# Altium schematic sheet EFR32BG24_PartB.SchDoc: LPEDT_Project_Schematic
size A; Revision: 1; SheetNumber: 5; SheetTotal: 7
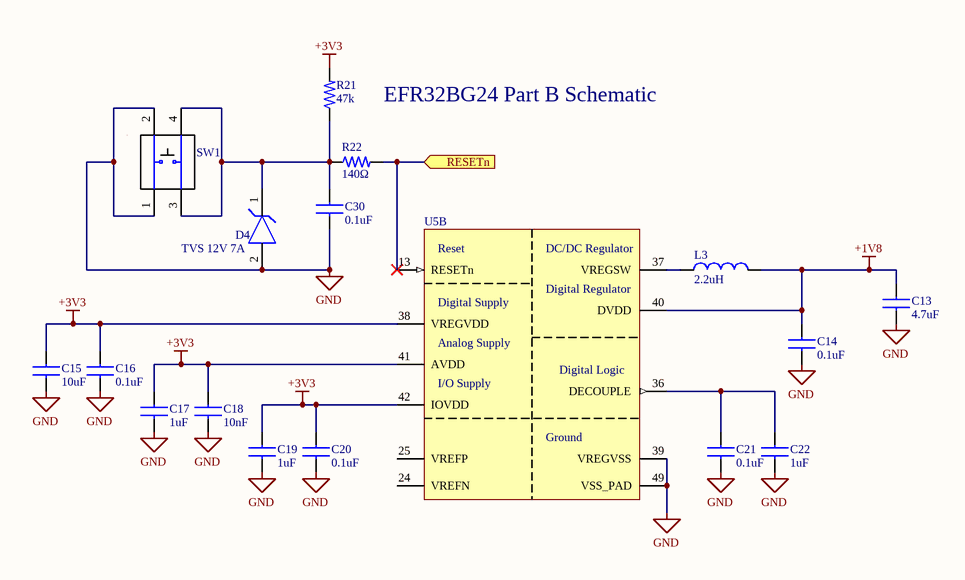
[diagram p0: EFR32BG24_PartB.SchDoc]

## Parts
C13  4.7uF  [C_0603]
C14  0.1uF  [C_0603]
C15  10uF  [C_0603]
C16  0.1uF  [C_0603]
C17  1uF  [C_0603]
C18  10nF  [C_0603]
C19  1uF  [C_0603]
C20  0.1uF  [C_0603]
C21  0.1uF  [C_0603]
C22  1uF  [C_0603]
C30  0.1uF  [C_0603]
D4  TVS 12V 7A  [D_TVS]
L3  2.2uH  [L_2828x30]
R21  47k  [R_0603]
R22  140Ω  [R_0603]
SW1  SW_TactilePushButton  [SW_Tactile]  (value not drawn)
U5  EFR32BG24B110F1536IM48-B  [U_48QFN_6x6_2]  (value not drawn)  (part B of 3)

## Ports
RESETn (in, see EFR32BG24_PartC[4A])

## Nets
+1V8: C13.1 C14.1 L3.2 U5.40(DVDD)
+3V3: C15.1 C16.2 C17.2 C18.1 C19.2 C20.2 R21.2 U5.38(VREGVDD) U5.41(AVDD) U5.42(IOVDD)
GND: C13.2 C14.2 C15.2 C16.1 C17.1 C18.2 C19.1 C20.1 C21.2 C22.2 C30.2 D4.2 SW1.1 SW1.2 U5.39(VREGVSS) U5.49(VSS_PAD)
RESETn: R22.2 U5.13(RESETn) ; port RESETn
NetC21_1: C21.1 C22.1 U5.36(DECOUPLE)
NetC30_1: C30.1 D4.1 R21.1 R22.1 SW1.3 SW1.4
NetL3_1: L3.1 U5.37(VREGSW)

Not connected (* = marked no-connect by the designer): U5 24(VREFN) 25(VREFP)

## Notes on the sheet
- EFR32BG24 Part B Schematic
- (in symbol EFR32BG24B110F1536IM48-B, part B) Reset; DC/DC Regulator; Digital Regulator; Digital Supply; Analog Supply; Digital Logic; I/O Supply; Ground

## Library data of the parts
C13 = C_4.7U_0603: CAP CER 4.7UF 10V X5R 0603; Manufacturer: Murata; Manufacturer Part Number: GRM188R61A475KAAJD; Dielectric Material: Ceramic; Multilayer: Yes; Tolerance  (fill in as +-): 10%; Supplier: Digikey; Supplier Part Number: 490-14373-1-ND; RoHS: Yes; Category: Ceramic Capacitors; Stock: 53982; Pricing: 1=0.38, 10=0.251, 50=0.185, 100=0.1506, 500=0.11888, 1000=0.10039 (USD); Mounting Technology: Surface Mount; Pins: 2; Package Shape: Rectangular; Case/Package: 0603; Terminal Finish: Nickel; Min Operating Temperature: -55°C; Max Operating Temperature: 85°C; JESD-609 Code: e3; Value: 4.7uF; Capacitor Type: Ceramic; Packaging: Tape and Reel; Tolerance (fill in as +-): 10%; Rated DC Voltage (URdc): 10V; Temperature Characteristics Code: X5R; Termination: Wraparound; Reach SVHC Compliant: Yes; RoHS Compliant: Yes; ComponentLink1URL: https://datasheet.ciiva.com:443/pdfs/VipMasterIC/IC/MURE/MURE-S-A0004349797/MURE-S-A0004352595-1.pdf?src-supplier=IHS+Markit; ComponentLink1Description: https://datasheet.ciiva.com:443/pdfs/VipMasterIC/IC/MURE/MURE-S-A0004349797/MURE-S-A0004352595-1.pdf?src-supplier=IHS+Markit; ComponentLink2URL: http://search.murata.co.jp/Ceramy/image/img/A01X/G101/ENG/GRM188R61A475KAAJ-01.pdf?src-supplier=Digikey; ComponentLink2Description: http://search.murata.co.jp/Ceramy/image/img/A01X/G101/ENG/GRM188R61A475KAAJ-01.pdf?src-supplier=Digikey
C14 C16 C20 C21 C30 = C_0.1U_0603: CAP CER 0.1UF 10V X5R 0603; Manufacturer: KEMET; Manufacturer Part Number: C0603C104K8PAC7867; Dielectric Material: Ceramic; Supplier: Digikey; Supplier Part Number: 399-17573-1-ND; RoHS: Yes; Category: Ceramic Capacitors; Stock: 13122; Pricing: 1=0.18, 10=0.119, 50=0.075, 100=0.06, 500=0.04332, 1000=0.03833 (USD); Pins: 2; Capacitor Type: Ceramic; Reach SVHC Compliant: Yes; RoHS Compliant: Yes; ComponentLink1URL: https://datasheet.ciiva.com:443/pdfs/VipMasterIC/IC/KEME/KEME-S-A0007617622/KEME-S-A0007611556-1.pdf?src-supplier=IHS+Markit; ComponentLink1Description: https://datasheet.ciiva.com:443/pdfs/VipMasterIC/IC/KEME/KEME-S-A0007617622/KEME-S-A0007611556-1.pdf?src-supplier=IHS+Markit; ComponentLink2URL: https://api.kemet.com/component-edge/download/datasheet/C0603C104K8PAC7867.pdf?src-supplier=Digikey; ComponentLink2Description: https://api.kemet.com/component-edge/download/datasheet/C0603C104K8PAC7867.pdf?src-supplier=Digikey
C15 = C_10U_0603: CAP CER 10UF 10V X5R 0603; Manufacturer: Murata; Manufacturer Part Number: GRM188R61A106ME69D; Dielectric Material: Ceramic; Multilayer: Yes; Tolerance  (fill in as +-): 20%; Supplier: Digikey; Supplier Part Number: 490-10475-1-ND; RoHS: Yes; Category: Ceramic Capacitors; Stock: 841748; Pricing: 1=0.14, 10=0.098, 50=0.0584, 100=0.0459, 500=0.03392, 1000=0.02809 (USD); Mounting Technology: Surface Mount; Pins: 2; Package Shape: Rectangular; Case/Package: 0603; Terminal Finish: Nickel; Min Operating Temperature: -55°C; Max Operating Temperature: 85°C; JESD-609 Code: e3; Value: 10uF; Capacitor Type: Ceramic; Packaging: Tape and Reel; Tolerance (fill in as +-): 20%; Rated DC Voltage (URdc): 10V; Temperature Characteristics Code: X5R; Termination: Wraparound; Reach SVHC Compliant: Yes; RoHS Compliant: Yes; ComponentLink1URL: https://datasheet.ciiva.com:443/pdfs/VipMasterIC/IC/MURE/MURE-S-A0004349797/MURE-S-A0004352786-1.pdf?src-supplier=IHS+Markit; ComponentLink1Description: https://datasheet.ciiva.com:443/pdfs/VipMasterIC/IC/MURE/MURE-S-A0004349797/MURE-S-A0004352786-1.pdf?src-supplier=IHS+Markit; ComponentLink2URL: http://www.farnell.com/datasheets/1872210.pdf?src-supplier=Farnell; ComponentLink2Description: http://www.farnell.com/datasheets/1872210.pdf?src-supplier=Farnell; ComponentLink3URL: http://www.mouser.com/ds/2/281/c02e-2905.pdf?src-supplier=Mouser; ComponentLink3Description: http://www.mouser.com/ds/2/281/c02e-2905.pdf?src-supplier=Mouser; ComponentLink4URL: https://datasheet.octopart.com/GRM188R61A106ME69D-Murata-datasheet-22122223.pdf?src-supplier=Future+Electronics; ComponentLink4Description: https://datasheet.octopart.com/GRM188R61A106ME69D-Murata-datasheet-22122223.pdf?src-supplier=Future+Electronics; ComponentLink5URL: https://datasheet.octopart.com/GRM188R61A106ME69D-Murata-datasheet-62317187.pdf?src-supplier=Element14; ComponentLink5Description: https://datasheet.octopart.com/GRM188R61A106ME69D-Murata-datasheet-62317187.pdf?src-supplier=Element14; ComponentLink6URL: http://www.farnell.com/datasheets/1872210.pdf?src-supplier=Newark; ComponentLink6Description: http://www.farnell.com/datasheets/1872210.pdf?src-supplier=Newark; ComponentLink7URL: http://www.farnell.com/datasheets/2048014.pdf?src-supplier=Element14; ComponentLink7Description: http://www.farnell.com/datasheets/2048014.pdf?src-supplier=Element14; ComponentLink8URL: https://datasheet.octopart.com/GRM188R61A106ME69D-Murata-datasheet-165579666.pdf?src-supplier=TME; ComponentLink8Description: https://datasheet.octopart.com/GRM188R61A106ME69D-Murata-datasheet-165579666.pdf?src-supplier=TME
C17 C19 C22 = C_1U_0603: CAP CER 1UF 10V X5R 0603; Manufacturer: Murata; Manufacturer Part Number: GRM188R61A105KA61D; Dielectric Material: Ceramic; Multilayer: Yes; Tolerance  (fill in as +-): 10%; Supplier: Digikey; Supplier Part Number: 490-1543-1-ND; RoHS: Yes; Category: Ceramic Capacitors; Stock: 1314759; Pricing: 1=0.12, 10=0.08, 50=0.048, 100=0.0378, 500=0.02794, 1000=0.02313 (USD); Mounting Technology: Surface Mount; Pins: 2; Package Shape: Rectangular; Case/Package: 0603; Terminal Finish: Nickel; Min Operating Temperature: -55°C; Max Operating Temperature: 85°C; JESD-609 Code: e3; Value: 1uF; Capacitor Type: Ceramic; Package Style: SMTMeter; Packaging: Tape and Reel; Tolerance (fill in as +-): 10%; Rated DC Voltage (URdc): 10V; Temperature Characteristics Code: X5R; Termination: Wraparound; Length: 1.6mm; Width: 0.8mm; Height: 0.8mm; Reach SVHC Compliant: Yes; RoHS Compliant: Yes; ComponentLink1URL: https://psearch.en.murata.com:443/capacitor/product/GRM188R61A105KA61%23.pdf?src-supplier=IHS+Markit; ComponentLink1Description: https://psearch.en.murata.com:443/capacitor/product/GRM188R61A105KA61%23.pdf?src-supplier=IHS+Markit; ComponentLink2URL: https://datasheet.ciiva.com/19476/1857381-19476568.pdf?src-supplier=Jameco; ComponentLink2Description: https://datasheet.ciiva.com/19476/1857381-19476568.pdf?src-supplier=Jameco; ComponentLink3URL: https://datasheet.ciiva.com/18102/getdatasheetpartid-85467-18102910.pdf?src-supplier=Verical; ComponentLink3Description: https://datasheet.ciiva.com/18102/getdatasheetpartid-85467-18102910.pdf?src-supplier=Verical; ComponentLink4URL: https://datasheet.ciiva.com/7719/608985-7719036.pdf?src-supplier=Element14; ComponentLink4Description: https://datasheet.ciiva.com/7719/608985-7719036.pdf?src-supplier=Element14; ComponentLink5URL: https://datasheet.ciiva.com/22706/608985-22706782.pdf?src-supplier=Element14; ComponentLink5Description: https://datasheet.ciiva.com/22706/608985-22706782.pdf?src-supplier=Element14; ComponentLink6URL: https://datasheet.ciiva.com/131/partnumbering-e-01-131742.pdf?src-supplier=Digikey; ComponentLink6Description: https://datasheet.ciiva.com/131/partnumbering-e-01-131742.pdf?src-supplier=Digikey; ComponentLink7URL: https://datasheet.ciiva.com/131/partnumbering-e-01-131741.pdf?src-supplier=Digikey; ComponentLink7Description: https://datasheet.ciiva.com/131/partnumbering-e-01-131741.pdf?src-supplier=Digikey; ComponentLink8URL: https://datasheet.ciiva.com/131/partnumbering-e-01-131743.pdf?src-supplier=Digikey; ComponentLink8Description: https://datasheet.ciiva.com/131/partnumbering-e-01-131743.pdf?src-supplier=Digikey; ComponentLink9URL: https://datasheet.ciiva.com/16199/product-16199724.pdf?src-supplier=Future+Electronics; ComponentLink9Description: https://datasheet.ciiva.com/16199/product-16199724.pdf?src-supplier=Future+Electronics
C18 = C_10N_0603: Ceramic Capacitor, Multilayer, Ceramic, 100V, 10% +Tol, 10% -Tol, X7R, 15% TC, 0.01uF, Surface Mount, 0603; Manufacturer: Murata; Manufacturer Part Number: GCM188R72A103KA37D; Multilayer: Yes; Reference Standard: AEC-Q200; Supplier: Digikey; Supplier Part Number: 490-4781-6-ND; RoHS: Yes; Category: Ceramic Capacitors; Stock: 7901608; Pricing: 1=0.1, 10=0.038, 50=0.0218, 100=0.0168, 500=0.01268, 1000=0.00996 (USD); Mounting Technology: Surface Mount; Pins: 2; Dielectric Material: Ceramic; Package Shape: Rectangular; Case/Package: 0603; Terminal Finish: Nickel; Min Operating Temperature: -55°C; Max Operating Temperature: 125°C; JESD-609 Code: e3; Value: 10nF; Capacitor Type: Ceramic; Tolerance  (fill in as +-): 10%; Package Style: SMTMeter; Packaging: Tape and Reel; Tolerance (fill in as +-): 10%; Rated DC Voltage (URdc): 100V; Temperature Characteristics Code: X7R; Termination: Wraparound; Length: 1.6mm; Width: 0.8mm; Height: 0.9mm; Reach SVHC Compliant: Yes; RoHS Compliant: Yes; ComponentLink1URL: https://psearch.en.murata.com:443/capacitor/product/GCM188R72A103KA37%23.pdf?src-supplier=IHS+Markit; ComponentLink1Description: https://psearch.en.murata.com:443/capacitor/product/GCM188R72A103KA37%23.pdf?src-supplier=IHS+Markit; ComponentLink2URL: https://datasheet.ciiva.com/132/product-132908.pdf?src-supplier=Digikey; ComponentLink2Description: https://datasheet.ciiva.com/132/product-132908.pdf?src-supplier=Digikey; ComponentLink3URL: https://datasheet.ciiva.com/132/product-132907.pdf?src-supplier=Digikey; ComponentLink3Description: https://datasheet.ciiva.com/132/product-132907.pdf?src-supplier=Digikey; ComponentLink4URL: https://datasheet.ciiva.com/132/product-132909.pdf?src-supplier=Digikey; ComponentLink4Description: https://datasheet.ciiva.com/132/product-132909.pdf?src-supplier=Digikey; ComponentLink5URL: https://datasheet.ciiva.com/11786/0900766b80ef92d0-11786108.pdf?src-supplier=Rs; ComponentLink5Description: https://datasheet.ciiva.com/11786/0900766b80ef92d0-11786108.pdf?src-supplier=Rs; ComponentLink6URL: https://datasheet.ciiva.com/16497/product-16497251.pdf?src-supplier=Future+Electronics; ComponentLink6Description: https://datasheet.ciiva.com/16497/product-16497251.pdf?src-supplier=Future+Electronics; ComponentLink7URL: https://datasheet.ciiva.com/18183/getdatasheetpartid-178890-18183651.pdf?src-supplier=Verical; ComponentLink7Description: https://datasheet.ciiva.com/18183/getdatasheetpartid-178890-18183651.pdf?src-supplier=Verical; ComponentLink8URL: https://datasheet.ciiva.com/11619/product-11619719.pdf?src-supplier=Avnet; ComponentLink8Description: https://datasheet.ciiva.com/11619/product-11619719.pdf?src-supplier=Avnet
D4 = D_TVS_7A: TVS DIODE 5VWM 12VC SOD723; Manufacturer: Littelfuse; Manufacturer Part Number: SP1003-01DTG; Direction: Unidirectional; Reverse Breakdown Voltage: 6V; Operating Supply Voltage: 5V; Value: 30pF; Number of Channels: 1; Power Line Protection: No; Polarity: Bidirectional,Unidirectional; Test Current: 1mA; Leakage Current: 100nA; Diode Type: ZENER; Clamping Voltage-Max: 12.5V; Supplier: Digikey; Supplier Part Number: F3377CT-ND; RoHS: Yes; Category: TVS Diodes; Stock: 109631; Pricing: 1=0.53, 10=0.41, 100=0.2459, 500=0.22772, 1000=0.15485, 2000=0.14255 (USD); Mounting Technology: Surface Mount; Pins: 2; Min Operating Temperature: -40°C; Max Operating Temperature: 85°C; Packaging: Tape and Reel; Package Quantity: 8000; Max Surge Current: 7A; Number of Unidirectional Channels: 1; Reverse Standoff Voltage: 5V; Min Breakdown Voltage: 6V; Clamping Voltage: 12V; Breakdown Voltage: 5V; Termination: SMD/SMT; Number of Elements: 1; Peak Pulse Current: 7A; Series: SP1003, SPA®; Reach SVHC Compliant: No; Lead Free: Lead Free; RoHS Compliant: Yes; ComponentLink1URL: https://datasheet.ciiva.com/8062/littelfuse-spa-sp1003-series-8062432.pdf?src-supplier=Element14; ComponentLink1Description: https://datasheet.ciiva.com/8062/littelfuse-spa-sp1003-series-8062432.pdf?src-supplier=Element14; ComponentLink2URL: https://datasheet.ciiva.com/5771/littelfuse-spa-sp1003-series-5771141.pdf?src-supplier=Farnell; ComponentLink2Description: https://datasheet.ciiva.com/5771/littelfuse-spa-sp1003-series-5771141.pdf?src-supplier=Farnell; ComponentLink3URL: https://datasheet.ciiva.com/330/littelfuse-tvs-diode-array-sp1003-datasheet-pdf-330691.pdf?src-supplier=Digikey; ComponentLink3Description: https://datasheet.ciiva.com/330/littelfuse-tvs-diode-array-sp1003-datasheet-pdf-330691.pdf?src-supplier=Digikey; ComponentLink4URL: https://datasheet.ciiva.com/330/littelfuse-tvs-diode-array-sp1003-datasheet-pdf-330692.pdf?src-supplier=Digikey; ComponentLink4Description: https://datasheet.ciiva.com/330/littelfuse-tvs-diode-array-sp1003-datasheet-pdf-330692.pdf?src-supplier=Digikey; ComponentLink5URL: https://datasheet.ciiva.com/330/littelfuse-tvs-diode-array-sp1003-datasheet-pdf-330693.pdf?src-supplier=Digikey; ComponentLink5Description: https://datasheet.ciiva.com/330/littelfuse-tvs-diode-array-sp1003-datasheet-pdf-330693.pdf?src-supplier=Digikey
L3 = L_2U2_2828: General Purpose Inductor, 2.2uH, 20%, 1 Element, Ferrite-Core, SMD, 1111; Manufacturer: Wurth Electronics; Manufacturer Part Number: 744025002; Channels: 1; Case/Size Code: 1111; DC Resistance (DCR): 101mR; Inductor Application: RF INDUCTOR; Max Current Rating: 1.5A; Self Resonant Frequency: 100MHz; Shape/Size Description: RECTANGULAR PACKAGE; Shielding: Unshielded; Test Frequency: 100kHz; Package Height: 2.8mm; Supplier: Digikey; Supplier Part Number: 732-2613-1-ND; RoHS: Yes; Category: Fixed Inductors; Stock: 733; Pricing: 1=1.64, 10=1.578, 50=1.45, 100=1.205, 250=1.088 (USD); Pins: 2; Terminal Finish: Copper; Core Material: Ferrite; Min Operating Temperature: -40°C; Max Operating Temperature: 125°C; Tolerance: 20%; JESD-609 Code: e2; Package Style: SMTMeter; Surface Mount: Yes; Construction: Chip; Inductance-Nom (L): 2.2uH; Inductor Type: GENERAL PURPOSE INDUCTOR; Packaging: Tape and Reel; Terminal Placement: Dual Ended; Termination: Wraparound; Package Length: 2.8mm; Package Width: 2.8mm; Reach SVHC Compliant: Yes; RoHS Compliant: Yes; ComponentLink1URL: https://datasheet.ciiva.com:443/pdfs/VipMasterIC/IC/MIDC/MIDC-S-A0002801410/MIDC-S-A0002801309-1.pdf?src-supplier=IHS+Markit; ComponentLink1Description: https://datasheet.ciiva.com:443/pdfs/VipMasterIC/IC/MIDC/MIDC-S-A0002801410/MIDC-S-A0002801309-1.pdf?src-supplier=IHS+Markit; ComponentLink2URL: https://datasheet.ciiva.com/4954/744025002-18097-4954597.pdf?src-supplier=Mouser; ComponentLink2Description: https://datasheet.ciiva.com/4954/744025002-18097-4954597.pdf?src-supplier=Mouser; ComponentLink3URL: https://datasheet.ciiva.com/6690/744025002-6690395.pdf?src-supplier=Digikey; ComponentLink3Description: https://datasheet.ciiva.com/6690/744025002-6690395.pdf?src-supplier=Digikey; ComponentLink4URL: https://datasheet.ciiva.com/11803/0900766b80f886b4-11803596.pdf?src-supplier=Rs; ComponentLink4Description: https://datasheet.ciiva.com/11803/0900766b80f886b4-11803596.pdf?src-supplier=Rs; ComponentLink5URL: https://datasheet.ciiva.com/6690/744025002-6690396.pdf?src-supplier=Digikey; ComponentLink5Description: https://datasheet.ciiva.com/6690/744025002-6690396.pdf?src-supplier=Digikey; ComponentLink6URL: https://datasheet.ciiva.com/6690/744025002-6690397.pdf?src-supplier=Digikey; ComponentLink6Description: https://datasheet.ciiva.com/6690/744025002-6690397.pdf?src-supplier=Digikey; ComponentLink7URL: https://datasheet.ciiva.com/48690/001087101-da-01-ml-we-tpc-smd-speicherdrossel-7440250-de-en-48690919.pdf?src-supplier=Conrad; ComponentLink7Description: https://datasheet.ciiva.com/48690/001087101-da-01-ml-we-tpc-smd-speicherdrossel-7440250-de-en-48690919.pdf?src-supplier=Conrad
R21 = R_47K_0603: Fixed Resistor, Metal Glaze/thick Film, 0.1W, 47000ohm, 75V, 1% +/-Tol, 100ppm/Cel, Surface Mount, 0603; Manufacturer: Yageo; Manufacturer Part Number: RC0603FR-0747KL; Additional Feature: LASER TRIMMABLE; Power: 100mW; Rated Temperature: 70°C; Value: 47kR; Temperature Coefficient: 100ppm/°C; Package Height: 0.45mm; Package Length: 1.6mm; Package Width: 0.8mm; Supplier: Digikey; Supplier Part Number: 311-47.0KHRCT-ND; RoHS: Yes; Category: Chip SMD Resistors; Stock: 9516223; Pricing: 1=0.1, 10=0.019, 50=0.0112, 100=0.0093, 500=0.00622, 1000=0.00532 (USD); Mounting Technology: Surface Mount; Pins: 2; Package Shape: Rectangular; Case/Package: 0603; Terminal Finish: Nickel; Min Operating Temperature: -55°C; Max Operating Temperature: 155°C; Tolerance: 1%; JESD-609 Code: e3; Resistor Type: FIXED RESISTOR; Construction: Chip; Package Style: SMTMeter; Packaging: Tape and Reel; Technology: METAL GLAZE/THICK FILM; Termination: Wraparound; Working Voltage: 75V; Reach SVHC Compliant: Yes; RoHS Compliant: Yes; ComponentLink1URL: https://datasheet.ciiva.com:443/pdfs/VipMasterIC/IC/YAGO/YAGO-S-A0008145938/YAGO-S-A0008145938-1.pdf?src-supplier=IHS+Markit; ComponentLink1Description: https://datasheet.ciiva.com:443/pdfs/VipMasterIC/IC/YAGO/YAGO-S-A0008145938/YAGO-S-A0008145938-1.pdf?src-supplier=IHS+Markit; ComponentLink2URL: https://datasheet.ciiva.com/11808/0900766b80f96399-11808118.pdf?src-supplier=Rs; ComponentLink2Description: https://datasheet.ciiva.com/11808/0900766b80f96399-11808118.pdf?src-supplier=Rs; ComponentLink3URL: https://datasheet.ciiva.com/2453/pyu-r-int-thick-7-2453932.pdf?src-supplier=Digikey; ComponentLink3Description: https://datasheet.ciiva.com/2453/pyu-r-int-thick-7-2453932.pdf?src-supplier=Digikey; ComponentLink4URL: https://datasheet.ciiva.com/2453/pyu-r-int-thick-7-2453933.pdf?src-supplier=Digikey; ComponentLink4Description: https://datasheet.ciiva.com/2453/pyu-r-int-thick-7-2453933.pdf?src-supplier=Digikey; ComponentLink5URL: https://datasheet.ciiva.com/2453/pyu-r-int-thick-7-2453931.pdf?src-supplier=Digikey; ComponentLink5Description: https://datasheet.ciiva.com/2453/pyu-r-int-thick-7-2453931.pdf?src-supplier=Digikey; ComponentLink6URL: https://datasheet.ciiva.com/7746/443971-7746362.pdf?src-supplier=Element14; ComponentLink6Description: https://datasheet.ciiva.com/7746/443971-7746362.pdf?src-supplier=Element14; ComponentLink7URL: https://datasheet.ciiva.com/7746/443971-7746361.pdf?src-supplier=Element14; ComponentLink7Description: https://datasheet.ciiva.com/7746/443971-7746361.pdf?src-supplier=Element14
R22 = R_140_0603: RES 140OHM 0.1w 0603; Manufacturer: Yageo; Manufacturer Part Number: RC0603FR-07140RL; Tolerance: 1%; Additional Feature: LASER TRIMMABLE; Power: 100mW; Rated Temperature: 70°C; Value: 140R; Temperature Coefficient: 100ppm/°C; Working Voltage: 75V; Package Height: 0.45mm; Package Length: 1.6mm; Package Width: 0.8mm; Supplier: Digikey; Supplier Part Number: 311-140HRCT-ND; RoHS: Yes; Category: Chip SMD Resistors; Stock: 298380; Pricing: 1=0.1, 10=0.019, 50=0.0112, 100=0.0093, 500=0.00622, 1000=0.00532 (USD); Mounting Technology: Surface Mount; Pins: 2; Package Shape: Rectangular; Case/Package: 0603; Terminal Finish: Nickel; Min Operating Temperature: -55°C; Max Operating Temperature: 155°C; JESD-609 Code: e3; Resistor Type: FIXED RESISTOR; Construction: Chip; Package Style: SMTMeter; Packaging: Tape and Reel; Technology: METAL GLAZE/THICK FILM; Termination: Wraparound; Reach SVHC Compliant: Yes; RoHS Compliant: Yes; ComponentLink1URL: https://datasheet.ciiva.com:443/pdfs/VipMasterIC/IC/YAGO/YAGO-S-A0008145938/YAGO-S-A0008145938-1.pdf?src-supplier=IHS+Markit; ComponentLink1Description: https://datasheet.ciiva.com:443/pdfs/VipMasterIC/IC/YAGO/YAGO-S-A0008145938/YAGO-S-A0008145938-1.pdf?src-supplier=IHS+Markit; ComponentLink2URL: https://datasheet.ciiva.com/11808/0900766b80c66297-11808828.pdf?src-supplier=Rs; ComponentLink2Description: https://datasheet.ciiva.com/11808/0900766b80c66297-11808828.pdf?src-supplier=Rs; ComponentLink3URL: https://datasheet.ciiva.com/15189/getdatasheetpartid-329205-15189606.pdf?src-supplier=Verical; ComponentLink3Description: https://datasheet.ciiva.com/15189/getdatasheetpartid-329205-15189606.pdf?src-supplier=Verical
SW1 = SW_TactilePushButton: 6 x 6 mm, 4.3 ~ 17 mm Actuator Height, 100 ~ 260 gf, Through Hole, SPST, Tactile Switch; Manufacturer: CUI Devices; Manufacturer Part Number: TS02-66-60-BK-100-LCR-D; Supplier: Digikey; Supplier Part Number: 2223-TS02-66-60-BK-100-LCR-D-ND; RoHS: No; Category: Tactile Switches; Stock: 3824; Pricing: 1=0.1, 10=0.097, 25=0.0916, 100=0.0833, 250=0.07832, 500=0.07166, 1000=0.05999, 2500=0.05833, 5000=0.05499 (USD)
U5 = EFR32BG24B110F1536IM48-B: BG24, 2.4 GHz, 1536kB Flash, 256kB RAM, +10 dBm, Secure Vault High, 20-bit ADC +125C, QFN48; Manufacturer: Silicon Labs; Supplier: Digikey; Supplier Part Number: 336-EFR32BG24B110F1536IM48-B-ND; Manufacturer Part Number: EFR32BG24B110F1536IM48-B; RoHS: No; Category: RF Receivers, Transceivers; Stock: 2713; Pricing: 1=7.9, 10=7.244, 25=6.5852, 80=5.92663, 230=5.43278, 490=4.9389, 980=4.44501 (USD)